# EAGLE design Mosfet switch options breakout board (EAGLE 8.3.1)
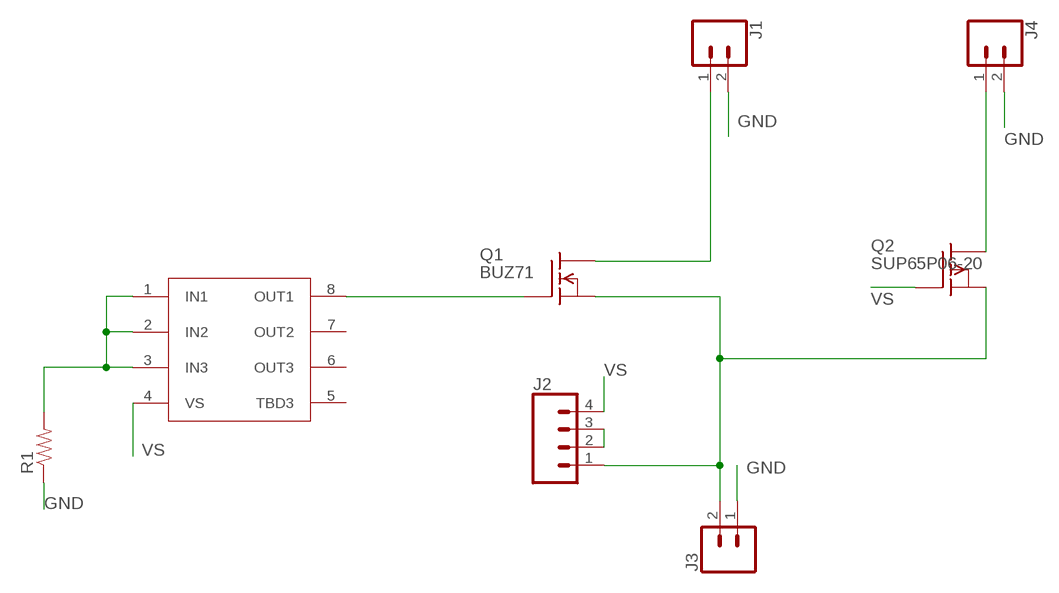
[diagram p0: schematic, sheet 1]

## Parts
J1  CONN_02  [1X02]
J2  CONN_04  [1X04]
J3  CONN_02  [1X02]
J4  CONN_02  [1X02]
Q1  BUZ71  [TO220]
Q2  SUP65P06-20  [TO220]
R1  RESISTOR0805  [0805]
U$1  (TEMP)MOSFET_DRIVER  [TSSOP-8]

## Nets
GND: J1.2 J3.1 J4.2 R1.1
N$1: Q1.1(G) U$1.8(OUT1)
N$2: R1.2 U$1.1(IN1) U$1.2(IN2) U$1.3(IN3)
N$3: J4.1 Q2.2(D)
N$4: J1.1 Q1.2(D)
N$5: J2.2 J2.3
VBATT: J2.1 J3.2 Q1.3(S) Q2.3(S)
VS: J2.4 Q2.1(G) U$1.4(VS)
Unconnected: U$1.5(TBD3) U$1.6(OUT3) U$1.7(OUT2)

## Library data of the parts
J1 J3 J4 = SparkFun-Connectors:CONN_02: Multi connection point. Often used as Generic Header-pin footprint for 0.1 inch spaced/style header connections On any of the 0.1 inch spaced packages, you can populate with these: Break Away Headers - Straight <https://www.sparkfun.com/products/116> (PRT-00116) Break Away Male Headers - Right Angle <https://www.sparkfun.com/products/553> (PRT-00553) Female Headers <https://www.sparkfun.com/products/115> (PRT-00115) Break Away Headers - Machine Pin <https://www.sparkfun.com/products/117> (PRT-00117) Break Away Female Headers - Swiss Machine Pin <https://www.sparkfun.com/products/743> (PRT-00743) For SCREWTERMINALS and SPRING TERMINALS visit here: Screw Terimnals on SparkFun.com <https://www.sparkfun.com/search/results?term=Screw+Terminals> (5mm/3.5mm/2.54mm spacing) This device is also useful as a general connection point to wire up your design to another part of your project. Our various solder wires solder well into these plated through hole pads. Hook-Up Wire - Assortment (Stranded, 22 AWG) <https://www.sparkfun.com/products/11375> (PRT-11375) Hook-Up Wire - Assortment (Solid Core, 22 AWG) <https://www.sparkfun.com/products/11367> (PRT-11367) View the entire wire category on our website here <https://www.sparkfun.com/categories/141> Special notes: Molex polarized connector foot print use with: PRT-08233 with associated crimp pins and housings. 2.54_SCREWTERM for use with PRT-10571. 3.5mm Screw Terminal footprints for PRT-08084 5mm Screw Terminal footprints for use with PRT-08432
J2 = SparkFun-Connectors:CONN_04: Multi connection point. Often used as Generic Header-pin footprint for 0.1 inch spaced/style header connections On any of the 0.1 inch spaced packages, you can populate with these: Break Away Headers - Straight <https://www.sparkfun.com/products/116> (PRT-00116) Break Away Male Headers - Right Angle <https://www.sparkfun.com/products/553> (PRT-00553) Female Headers <https://www.sparkfun.com/products/115> (PRT-00115) Break Away Headers - Machine Pin <https://www.sparkfun.com/products/117> (PRT-00117) Break Away Female Headers - Swiss Machine Pin <https://www.sparkfun.com/products/743> (PRT-00743) For SCREWTERMINALS and SPRING TERMINALS visit here: Screw Terimnals on SparkFun.com <https://www.sparkfun.com/search/results?term=Screw+Terminals> (5mm/3.5mm/2.54mm spacing) This device is also useful as a general connection point to wire up your design to another part of your project. Our various solder wires solder well into these plated through hole pads. Hook-Up Wire - Assortment (Stranded, 22 AWG) <https://www.sparkfun.com/products/11375> (PRT-11375) Hook-Up Wire - Assortment (Solid Core, 22 AWG) <https://www.sparkfun.com/products/11367> (PRT-11367) View the entire wire category on our website here <https://www.sparkfun.com/categories/141> Special notes: Molex polarized connector foot print use with SKU : PRT-08231 with associated crimp pins and housings. 1MM SMD Version SKU: PRT-10208; PROD_ID: CONN-09696
Q1 = transistor-fet:BUZ71: N-Channel Enhancement MOSFET 50V; 14A; 0,1Ohm
Q2 = transistor-fet:SUP65P06-20: P-Channel Enhancement MOSFET -60V; 60A; 0,020Ohm
R1 = DubSat1 Components:RESISTOR: Resistor Basic schematic elements and footprints for 0603, 1206, and PTH resistors.
U$1 = DubSat1 Components:(TEMP)MOSFET_DRIVER

## Board
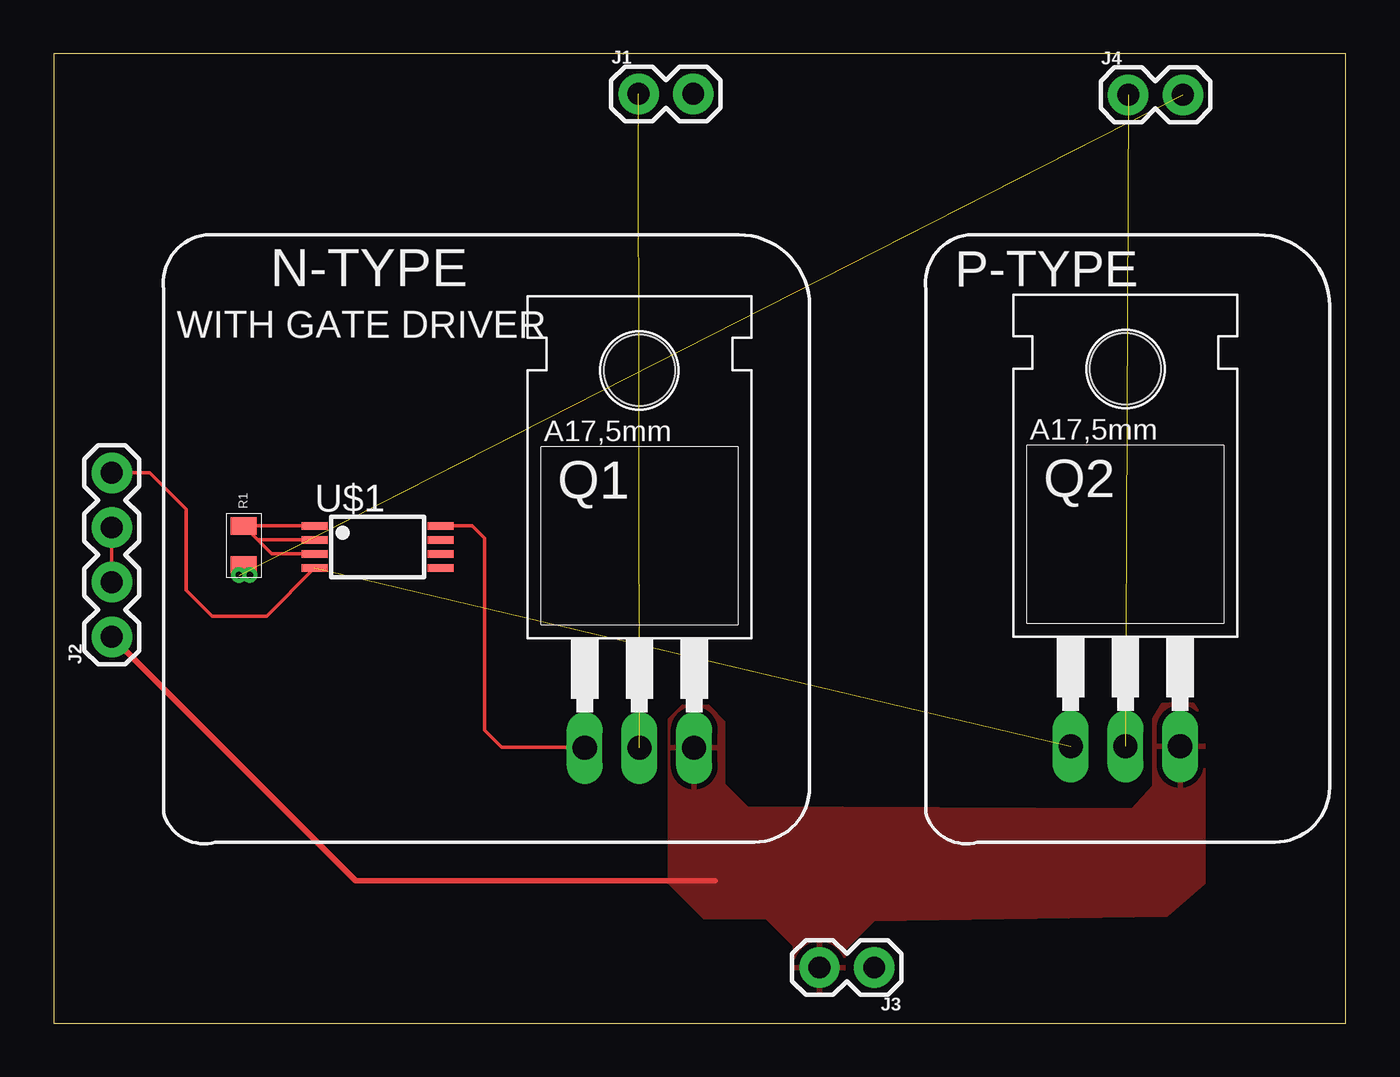
[diagram p1: board, top side]
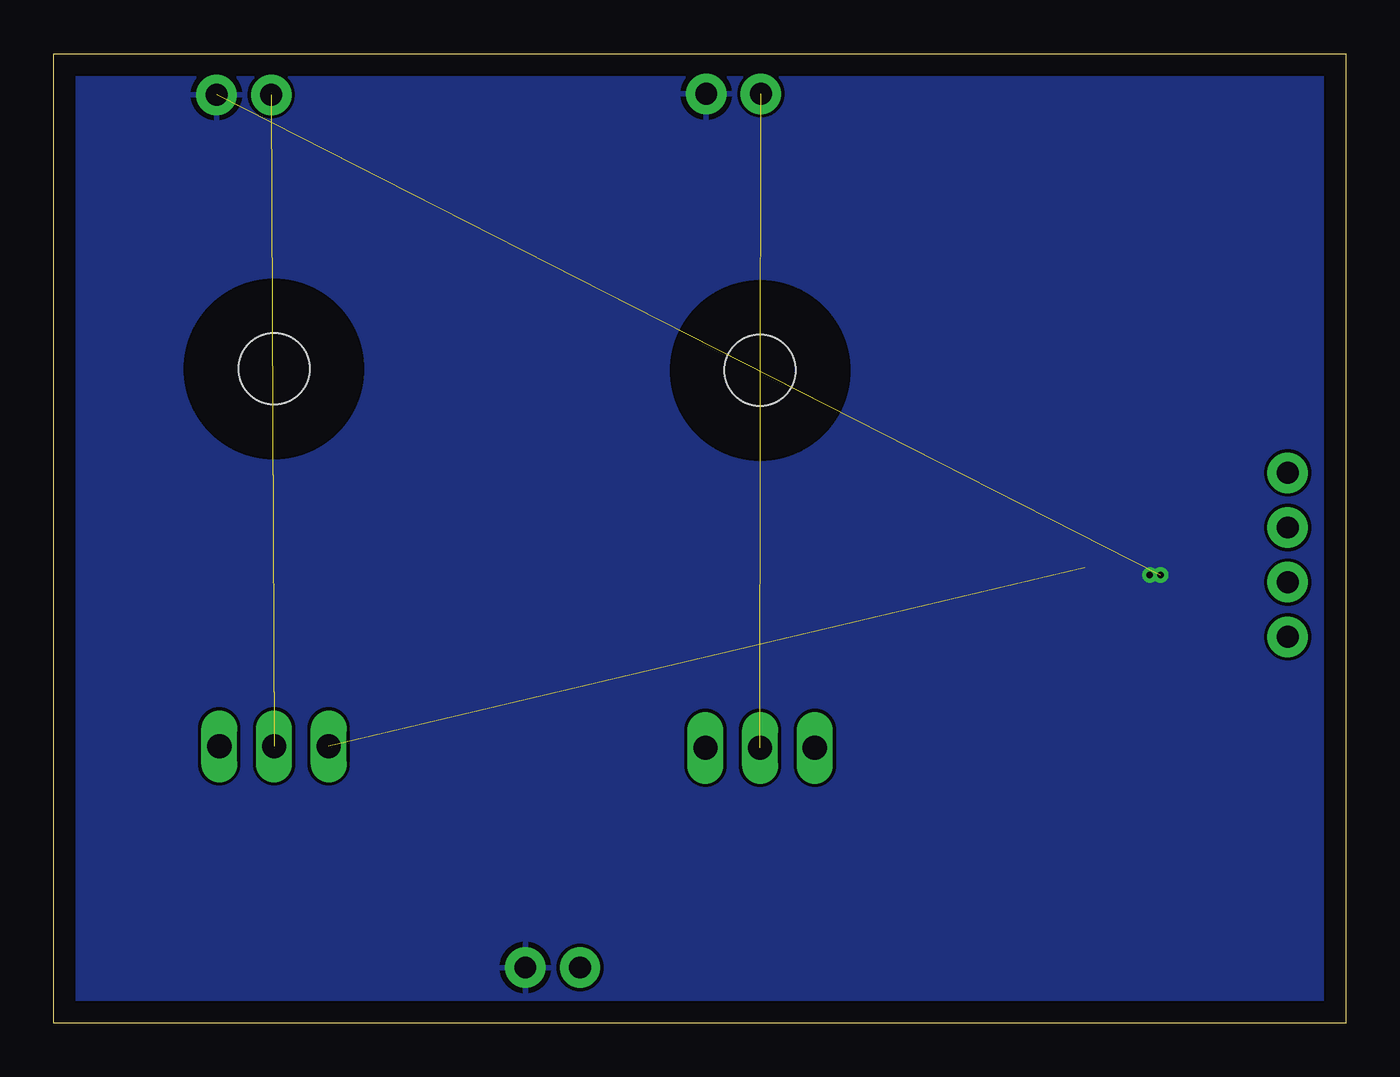
[diagram p2: board, bottom side, seen from below]

Size 60 x 45 mm. Coordinates in mm from the lower left corner, seen from the top.
Outline: 0,0 60,0 60,45 0,45 0,0
Copper layers (1*16): Top 0.035mm / dielectric 1.5mm / Bottom 0.035mm
Design rules "default": minimum track width 6mil, minimum drill 0.35mm, track to track 6mil, track to pad 6mil, pad to pad 6mil, via to via 6mil, smd to smd 6mil, copper to edge 40mil, drill to drill 6mil, minimum pad ring 10mil, minimum via ring 8mil, stop-mask expansion 4mil, vias tented up to drill 0mil, thermal gap 10mil

### Footprints (pad centres in the part's own frame; a part is rotated, then mirrored left to right if it is on the bottom)
1X02 = drill 1.016 pad 1.88: 1 0,0; 2 2.54,0
1X04 = drill 1.016 pad 1.88: 1 0,0; 2 2.54,0; 3 5.08,0; 4 7.62,0
TO220 = drill 1.118 long: 1 -2.54,-6.35; 2 0,-6.35; 3 2.54,-6.35 | hole 3.302: 0,11.176
0805 = smd 0.8 x 1.2: 1 -0.9,0; 2 0.9,0
TSSOP-8 = smd 1.2 x 0.35: 1 -4.175,1.725; 2 -4.175,1.075; 3 -4.175,0.425; 4 -4.175,-0.225; 5 1.675,-0.225; 6 1.675,0.425; 7 1.675,1.075; 8 1.675,1.725

### Placement (x,y rotation side)
J1  27.16,43.14 0 top
J2  2.69,17.93 90 top
J3  38.1,2.58 180 top
J4  49.9,43.1 0 top
Q1  27.2,19.13 0 top
Q2  49.77,19.2 0 top
R1  8.82,22.18 90 top
U$1  16.29,21.36 0 top

### Tracks (layer width: path | path; a pad name or v marks a point on that pad's centre or on a via)
GND  (via drill 0.3)  (1 unrouted)
  Top 0.152: v8.6,20.8 8.82,21.02 R1.1 8.82,21.08 v9.1,20.8
  pour Bottom: 0.1,0 0.1,45 60.1,45 60.1,-0.1 0.4,-0.1
N$1
  Top 0.152: U$1.8 19.41,23.09 20,22.5 20,13.6 20.8,12.8 24.64,12.8 Q1.1
N$2
  Top 0.152: R1.2 U$1.1 | R1.2 | 9.47,22.43 U$1.2 | 9.47,22.43 R1.2 | U$1.3 10.12,21.79 9.47,22.43
N$3  (1 unrouted)
N$4  (1 unrouted)
N$5
  Top 0.152: J2.3 J2.2
VBATT
  Top 0.254: J2.1 14.02,6.6 30.7,6.6
  pour Top: 36,1.4 36.7,2.1 36.7,3.4 38.1,4.8 51.7,5 53.4,6.5 53.4,14 52.9,14.8 51.5,14.8 51.1,14.1 51.1,11 50.1,9.9 32.2,10 31.1,11.1 31.1,14 30.4,14.7 29.2,14.7 28.6,14.1 28.6,6.5 30.2,4.9 33.1,4.9 34.4,3.6 34.4,1.8 34.9,1.3
VS  (1 unrouted)
  Top 0.152: J2.4 4.45,25.55 6.15,23.85 6.15,20.1 7.35,18.9 9.88,18.9 U$1.4

### Text on the board
tSilk: N-TYPE | P-TYPE | WITH GATE DRIVER